# Altium project 616-demo-PRJ.PrjPCB
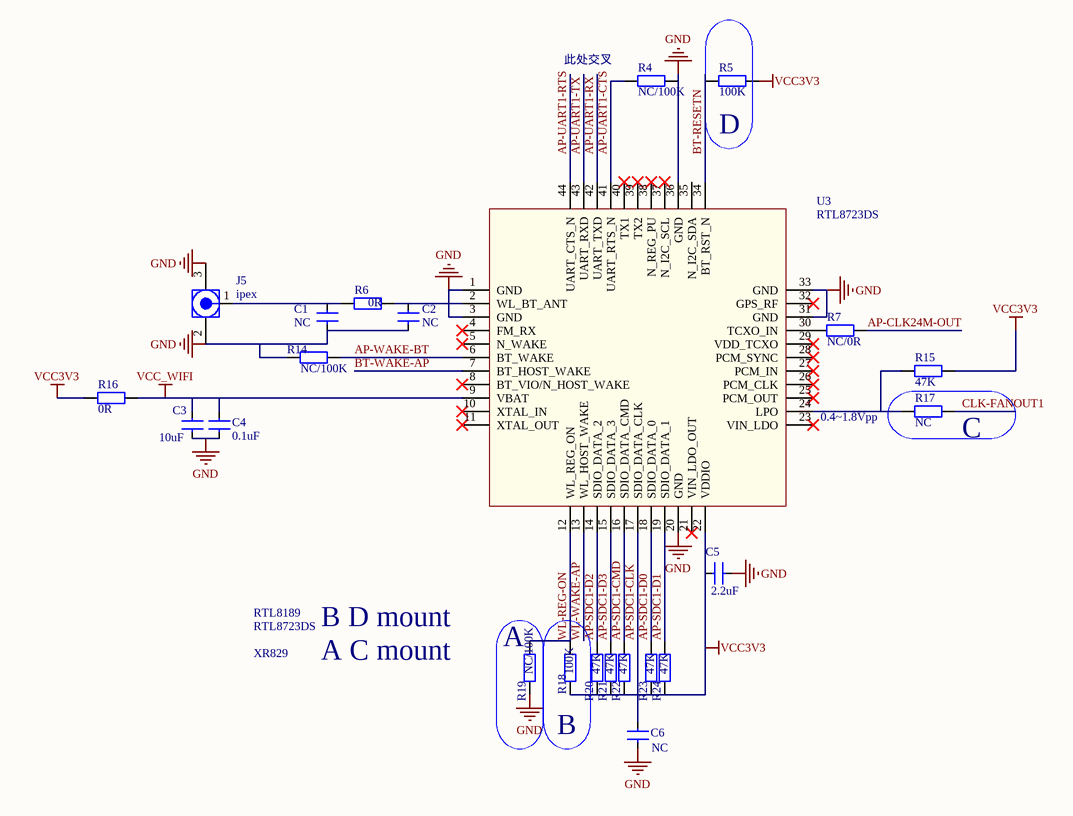
[diagram p0: WIFI-BT.SchDoc]
2 sheets, 70 parts. Net scope: global (net labels, ports and power ports of the same name join across sheets).
Board file: 616DEMO.PcbDoc
Sheets:
  WIFI-BT.SchDoc
  D1-Periph.SchDoc

## Sheet WIFI-BT.SchDoc
size A3

### Parts
C1  NC  [C0402]
C2  NC  [C0402]
C3  10uF  [C0402]
C4  0.1uF  [C0402]
C5  2.2uF  [C0402]
C6  NC  [C0402]
J5  ipex  [I-PEX SOCKET]
R4  NC/100K  [R0402]
R5  100K  [R0402]
R6  0R  [R0402]
R7  NC/0R  [R0402]
R14  NC/100K  [R0402]
R15  47K  [R0402]
R16  0R  [R0402]
R17  NC  [R0402]
R18  100K  [R0402]
R19  NC/100K  [R0402]
R20  47K  [R0402]
R21  47K  [R0402]
R22  47K  [R0402]
R23  47K  [R0402]
R24  47K  [R0402]
U3  RTL8723DS  [RTL8723DS]

### Blocks framed on the sheet
D: R5
A: R19
B: R18

### Nets
GND: C1.1 C2.1 C3.1 C4.1 C5.1 C6.1 J5.2(GND) J5.3(GND) R4.1 R14.2 R19.1 U3.1(GND) U3.3(GND) U3.20(GND) U3.31(GND) U3.33(GND) U3.36(GND)
VCC3V3: C5.2 R5.1 R15.2 R16.2 R18.1 R20.1 R21.1 R22.1 R23.1 R24.1 U3.22(VDDIO)
VCC_WIFI: C3.2 C4.2 R16.1 U3.9(VBAT)
AP-CLK24M-OUT: R7.1
AP-SDC1-CLK: C6.2 U3.17(SDIO_DATA_CLK)
AP-SDC1-CMD: R22.2 U3.16(SDIO_DATA_CMD)
AP-SDC1-D0: R23.2 U3.18(SDIO_DATA_0)
AP-SDC1-D1: R24.2 U3.19(SDIO_DATA_1)
AP-SDC1-D2: R20.2 U3.14(SDIO_DATA_2)
AP-SDC1-D3: R21.2 U3.15(SDIO_DATA_3)
AP-UART1-CTS: R4.2 U3.41(UART_RTS_N)
AP-UART1-RTS: U3.44(UART_CTS_N)
AP-UART1-RX: U3.42(UART_TXD)
AP-UART1-TX: U3.43(UART_RXD)
AP-WAKE-BT: R14.1 U3.6(BT_WAKE)
BT-RESETN: R5.2 U3.34(BT_RST_N)
BT-WAKE-AP: U3.7(BT_HOST_WAKE)
CLK-FANOUT1: R17.1
WL-REG-ON: R18.2 R19.2 U3.12(WL_REG_ON)
WL-WAKE-AP: U3.13(WL_HOST_WAKE)
NetC1_2: C1.2 J5.1(Signal) R6.2
NetC2_2: C2.2 R6.1 U3.2(WL_BT_ANT)
NetR7_2: R7.2 U3.30(TCXO_IN)
NetR15_1: R15.1 R17.2 U3.24(LPO)

Not connected (* = marked no-connect by the designer): U3 4(FM_RX)* 5(N_WAKE)* 8(BT_VIO/N_HOST_WAKE)* 10(XTAL_IN)* 11(XTAL_OUT)* 21(VIN_LDO_OUT)* 23(VIN_LDO)* 25(PCM_OUT)* 26(PCM_CLK)* 27(PCM_IN)* 28(PCM_SYNC)* 29(VDD_TCXO)* 32(GPS_RF)* 35(N_I2C_SDA) 37(N_I2C_SCL)* 38(N_REG_PU)* 39(TX2)* 40(TX1)*

### Notes on the sheet
- (near R4) 此处交叉
- 0.4~1.8Vpp
- (near R17) C
- RTL8723DS
- XR829
- RTL8189
- B D mount
- A C mount

### Library data of the parts
C1-C6 = CAP: 普通小电容
J5 = MCX_IPEX
R4-R7 R14-R24 = RES: 普通电阻
U3 = AP6212

## Sheet D1-Periph.SchDoc
size A3; DocumentNumber: 3; SheetNumber: 3; SheetTotal: 7
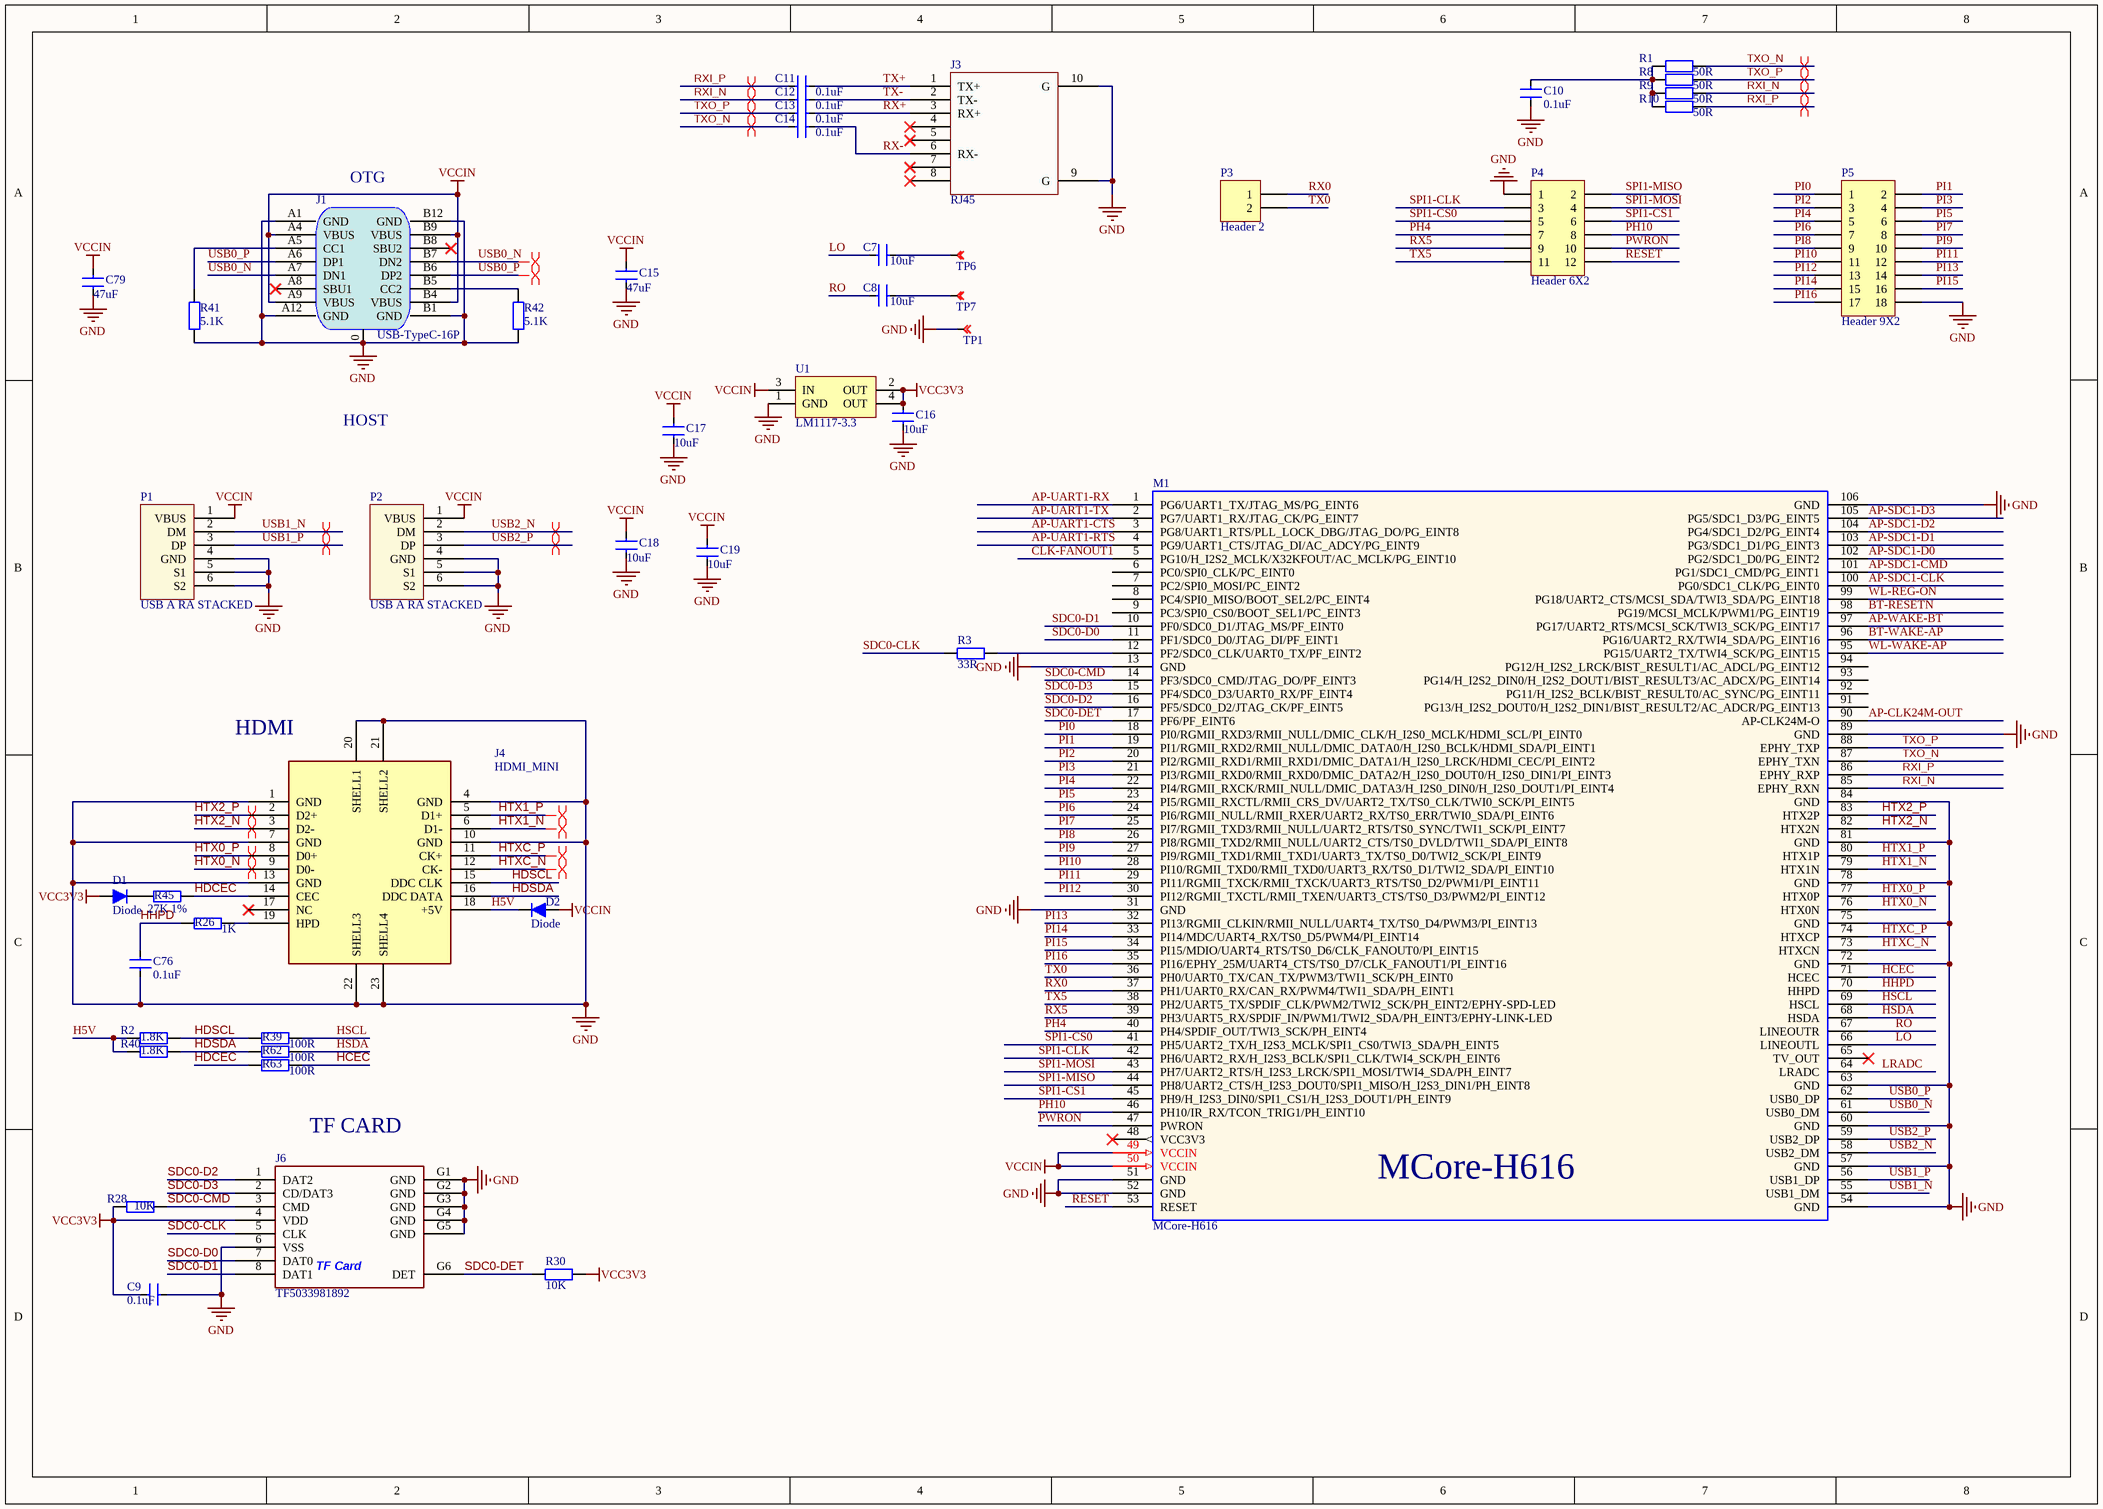
[diagram p1: D1-Periph.SchDoc]

### Parts
C7  10uF  [C0402]
C8  10uF  [C0402]
C9  0.1uF  [C0402]
C10  0.1uF  [C0402]
C11  0.1uF  [C0402]
C12  0.1uF  [C0402]
C13  0.1uF  [C0402]
C14  0.1uF  [C0402]
C15  47uF  [C0603]
C16  10uF  [C0402]
C17  10uF  [C0402]
C18  10uF  [C0402]
C19  10uF  [C0402]
C76  0.1uF  [C0402]
C79  47uF  [C0603]
D1  Diode  [SOD523]
D2  Diode  [SOD523]
J1  USB-TypeC-16P  [usb-typec-16p]
J3  RJ45  [RJ45]
J4  HDMI_MINI  [HDMI_T _mini]
J6  TF5033981892  [TFCARD-1040310811]
M1  MCore-H616  [MCore-H616]
P1  USB A RA STACKED  [USB-A STAND]
P2  USB A RA STACKED  [USB-A STAND]
P3  Header 2  [HDR1X2]
P4  Header 6X2  [HDR2X6]
P5  Header 9X2  [HDR2X9]
R1  50R  [R0402]
R2  1.8K  [R0402]
R3  33R  [R0402]
R8  50R  [R0402]
R9  50R  [R0402]
R10  50R  [R0402]
R26  1K  [R0402]
R28  10K  [R0402]
R30  10K  [R0402]
R39  100R  [R0402]
R40  1.8K  [R0402]
R41  5.1K  [R0402]
R42  5.1K  [R0402]
R45  27K 1%  [R0402]
R62  100R  [R0402]
R63  100R  [R0402]
TP1  TEST POINT  [TEST-POINT1.5]  (value not drawn)
TP6  TEST POINT  [TEST-POINT1.5]  (value not drawn)
TP7  TEST POINT  [TEST-POINT1.5]  (value not drawn)
U1  LM1117-3.3  [SOT223-4N]

### Nets
GND: C9.2 C10.1 C15.2 C16.2 C17.2 C18.2 C19.2 C76.1 C79.2 J1.0 J1.A1(GND) J1.A12(GND) J1.B1(GND) J1.B12(GND) J3.9(G) J3.10(G) J4.1(GND) J4.4(GND) J4.7(GND) J4.10(GND) J4.13(GND) J4.20(SHELL1) J4.21(SHELL2) J4.22(SHELL3) J4.23(SHELL4) J6.6(VSS) J6.G1(GND) J6.G2(GND) J6.G3(GND) J6.G4(GND) J6.G5(GND) M1.13(GND) M1.31(GND) M1.51(GND) M1.52(GND) M1.54(GND) M1.57(GND) M1.60(GND) M1.63(GND) M1.72(GND) M1.75(GND) M1.78(GND) M1.81(GND) M1.84(GND) M1.89(GND) M1.106(GND) P1.4(GND) P1.5(S1) P1.6(S2) P2.4(GND) P2.5(S1) P2.6(S2) P4.1 P5.18 R41.1 R42.1 TP1.1 U1.1(GND)
VCC3V3: C9.1 C16.1 D1.A J6.4(VDD) R28.1 R30.1 U1.2(OUT) U1.4(OUT)
VCCIN: C15.1 C17.1 C18.1 C19.1 C79.1 D2.A J1.A4(VBUS) J1.A9(VBUS) J1.B4(VBUS) J1.B9(VBUS) M1.49(VCCIN) M1.50(VCCIN) P1.1(VBUS) P2.1(VBUS) U1.3(IN)
AP-CLK24M-OUT: M1.90(AP-CLK24M-O)
AP-SDC1-CLK: M1.100(PG0/SDC1_CLK/PG_EINT0)
AP-SDC1-CMD: M1.101(PG1/SDC1_CMD/PG_EINT1)
AP-SDC1-D0: M1.102(PG2/SDC1_D0/PG_EINT2)
AP-SDC1-D1: M1.103(PG3/SDC1_D1/PG_EINT3)
AP-SDC1-D2: M1.104(PG4/SDC1_D2/PG_EINT4)
AP-SDC1-D3: M1.105(PG5/SDC1_D3/PG_EINT5)
AP-UART1-CTS: M1.3(PG8/UART1_RTS/PLL_LOCK_DBG/JTAG_DO/PG_EINT8)
AP-UART1-RTS: M1.4(PG9/UART1_CTS/JTAG_DI/AC_ADCY/PG_EINT9)
AP-UART1-RX: M1.1(PG6/UART1_TX/JTAG_MS/PG_EINT6)
AP-UART1-TX: M1.2(PG7/UART1_RX/JTAG_CK/PG_EINT7)
AP-WAKE-BT: M1.97(PG17/UART2_RTS/MCSI_SCK/TWI3_SCK/PG_EINT17)
BT-RESETN: M1.98(PG19/MCSI_MCLK/PWM1/PG_EINT19)
BT-WAKE-AP: M1.96(PG16/UART2_RX/TWI4_SDA/PG_EINT16)
CLK-FANOUT1: M1.5(PG10/H_I2S2_MCLK/X32KFOUT/AC_MCLK/PG_EINT10)
H5V: D2.K J4.18(+5V) R2.1 R40.1
HCEC: M1.71(HCEC) R63.1
HDCEC: J4.14(CEC) R45.1 R63.2
HDSCL: J4.15(DDC_CLK) R2.2 R39.2
HDSDA: J4.16(DDC_DATA) R40.2 R62.2
HHPD: C76.2 M1.70(HHPD) R26.2
HSCL: M1.69(HSCL) R39.1
HSDA: M1.68(HSDA) R62.1
HTX0_N: J4.9(D0-) M1.76(HTX0N)
HTX0_P: J4.8(D0+) M1.77(HTX0P)
HTX1_N: J4.6(D1-) M1.79(HTX1N)
HTX1_P: J4.5(D1+) M1.80(HTX1P)
HTX2_N: J4.3(D2-) M1.82(HTX2N)
HTX2_P: J4.2(D2+) M1.83(HTX2P)
HTXC_N: J4.12(CK-) M1.73(HTXCN)
HTXC_P: J4.11(CK+) M1.74(HTXCP)
LO: C7.1 M1.66(LINEOUTL)
LRADC: M1.64(LRADC)
PH4: M1.40(PH4/SPDIF_OUT/TWI3_SCK/PH_EINT4) P4.7
PH10: M1.46(PH10/IR_RX/TCON_TRIG1/PH_EINT10) P4.8
PI0: M1.18(PI0/RGMII_RXD3/RMII_NULL/DMIC_CLK/H_I2S0_MCLK/HDMI_SCL/PI_EINT0) P5.1
PI1: M1.19(PI1/RGMII_RXD2/RMII_NULL/DMIC_DATA0/H_I2S0_BCLK/HDMI_SDA/PI_EINT1) P5.2
PI2: M1.20(PI2/RGMII_RXD1/RMII_RXD1/DMIC_DATA1/H_I2S0_LRCK/HDMI_CEC/PI_EINT2) P5.3
PI3: M1.21(PI3/RGMII_RXD0/RMII_RXD0/DMIC_DATA2/H_I2S0_DOUT0/H_I2S0_DIN1/PI_EINT3) P5.4
PI4: M1.22(PI4/RGMII_RXCK/RMII_NULL/DMIC_DATA3/H_I2S0_DIN0/H_I2S0_DOUT1/PI_EINT4) P5.5
PI5: M1.23(PI5/RGMII_RXCTL/RMII_CRS_DV/UART2_TX/TS0_CLK/TWI0_SCK/PI_EINT5) P5.6
PI6: M1.24(PI6/RGMII_NULL/RMII_RXER/UART2_RX/TS0_ERR/TWI0_SDA/PI_EINT6) P5.7
PI7: M1.25(PI7/RGMII_TXD3/RMII_NULL/UART2_RTS/TS0_SYNC/TWI1_SCK/PI_EINT7) P5.8
PI8: M1.26(PI8/RGMII_TXD2/RMII_NULL/UART2_CTS/TS0_DVLD/TWI1_SDA/PI_EINT8) P5.9
PI9: M1.27(PI9/RGMII_TXD1/RMII_TXD1/UART3_TX/TS0_D0/TWI2_SCK/PI_EINT9) P5.10
PI10: M1.28(PI10/RGMII_TXD0/RMII_TXD0/UART3_RX/TS0_D1/TWI2_SDA/PI_EINT10) P5.11
PI11: M1.29(PI11/RGMII_TXCK/RMII_TXCK/UART3_RTS/TS0_D2/PWM1/PI_EINT11) P5.12
PI12: M1.30(PI12/RGMII_TXCTL/RMII_TXEN/UART3_CTS/TS0_D3/PWM2/PI_EINT12) P5.13
PI13: M1.32(PI13/RGMII_CLKIN/RMII_NULL/UART4_TX/TS0_D4/PWM3/PI_EINT13) P5.14
PI14: M1.33(PI14/MDC/UART4_RX/TS0_D5/PWM4/PI_EINT14) P5.15
PI15: M1.34(PI15/MDIO/UART4_RTS/TS0_D6/CLK_FANOUT0/PI_EINT15) P5.16
PI16: M1.35(PI16/EPHY_25M/UART4_CTS/TS0_D7/CLK_FANOUT1/PI_EINT16) P5.17
PWRON: M1.47(PWRON) P4.10
RESET: M1.53(RESET) P4.12
RO: C8.1 M1.67(LINEOUTR)
RX0: M1.37(PH1/UART0_RX/CAN_RX/PWM4/TWI1_SDA/PH_EINT1) P3.1
RX5: M1.39(PH3/UART5_RX/SPDIF_IN/PWM1/TWI2_SDA/PH_EINT3/EPHY-LINK-LED) P4.9
RX+: C13.2 J3.3(RX+)
RX-: C14.2 J3.6(RX-)
RXI_N: C12.1 M1.85(EPHY_RXN) R9.1
RXI_P: C11.1 M1.86(EPHY_RXP) R10.1
SDC0-CLK: J6.5(CLK) R3.2
SDC0-CMD: J6.3(CMD) M1.14(PF3/SDC0_CMD/JTAG_DO/PF_EINT3) R28.2
SDC0-D0: J6.7(DAT0) M1.11(PF1/SDC0_D0/JTAG_DI/PF_EINT1)
SDC0-D1: J6.8(DAT1) M1.10(PF0/SDC0_D1/JTAG_MS/PF_EINT0)
SDC0-D2: J6.1(DAT2) M1.16(PF5/SDC0_D2/JTAG_CK/PF_EINT5)
SDC0-D3: J6.2(CD/DAT3) M1.15(PF4/SDC0_D3/UART0_RX/PF_EINT4)
SDC0-DET: J6.G6(DET) M1.17(PF6/PF_EINT6) R30.2
SPI1-CLK: M1.42(PH6/UART2_RX/H_I2S3_BCLK/SPI1_CLK/TWI4_SCK/PH_EINT6) P4.3
SPI1-CS0: M1.41(PH5/UART2_TX/H_I2S3_MCLK/SPI1_CS0/TWI3_SDA/PH_EINT5) P4.5
SPI1-CS1: M1.45(PH9/H_I2S3_DIN0/SPI1_CS1/H_I2S3_DOUT1/PH_EINT9) P4.6
SPI1-MISO: M1.44(PH8/UART2_CTS/H_I2S3_DOUT0/SPI1_MISO/H_I2S3_DIN1/PH_EINT8) P4.2
SPI1-MOSI: M1.43(PH7/UART2_RTS/H_I2S3_LRCK/SPI1_MOSI/TWI4_SDA/PH_EINT7) P4.4
TX0: M1.36(PH0/UART0_TX/CAN_TX/PWM3/TWI1_SCK/PH_EINT0) P3.2
TX5: M1.38(PH2/UART5_TX/SPDIF_CLK/PWM2/TWI2_SCK/PH_EINT2/EPHY-SPD-LED) P4.11
TX+: C11.2 J3.1(TX+)
TX-: C12.2 J3.2(TX-)
TXO_N: C14.1 M1.87(EPHY_TXN) R1.1
TXO_P: C13.1 M1.88(EPHY_TXP) R8.1
USB0_N: J1.A7(DN1) J1.B7(DN2) M1.61(USB0_DM)
USB0_P: J1.A6(DP1) J1.B6(DP2) M1.62(USB0_DP)
USB1_N: M1.55(USB1_DM) P1.2(DM)
USB1_P: M1.56(USB1_DP) P1.3(DP)
USB2_N: M1.58(USB2_DM) P2.2(DM)
USB2_P: M1.59(USB2_DP) P2.3(DP)
WL-REG-ON: M1.99(PG18/UART2_CTS/MCSI_SDA/TWI3_SDA/PG_EINT18)
WL-WAKE-AP: M1.95(PG15/UART2_TX/TWI4_SCK/PG_EINT15)
NetC7_2: C7.2 TP6.1
NetC8_2: C8.2 TP7.1
NetC10_2: C10.2 R1.2 R8.2 R9.2 R10.2
NetD1_K: D1.K R45.2
NetJ1_A5: J1.A5(CC1) R41.2
NetJ1_B5: J1.B5(CC2) R42.2
NetJ4_19: J4.19(HPD) R26.1
NetM1_12: M1.12(PF2/SDC0_CLK/UART0_TX/PF_EINT2) R3.1

Not connected (* = marked no-connect by the designer): J1 A8(SBU1)* B8(SBU2)*; J3 4* 5* 7* 8*; J4 17(NC)*; M1 6(PC0/SPI0_CLK/PC_EINT0) 7(PC2/SPI0_MOSI/PC_EINT2) 8(PC4/SPI0_MISO/BOOT_SEL2/PC_EINT4) 9(PC3/SPI0_CS0/BOOT_SEL1/PC_EINT3) 48(VCC3V3)* 65(TV_OUT)* 91(PG13/H_I2S2_DOUT0/H_I2S2_DIN1/BIST_RESULT2/AC_ADCR/PG_EINT13) 92(PG11/H_I2S2_BCLK/BIST_RESULT0/AC_SYNC/PG_EINT11) 93(PG14/H_I2S2_DIN0/H_I2S2_DOUT1/BIST_RESULT3/AC_ADCX/PG_EINT14) 94(PG12/H_I2S2_LRCK/BIST_RESULT1/AC_ADCL/PG_EINT12)

### Layout directives
differential pair: HTX0_N, HTX0_P, HTX1_N, HTX1_P, HTX2_N, HTX2_P, HTXC_N, HTXC_P, RXI_N, RXI_P, TXO_N, TXO_P, USB0_N, USB0_P, USB1_N, USB1_P, USB2_N, USB2_P

### Notes on the sheet
- (near J1) OTG
- HOST
- (near J4) HDMI
- TF CARD
- (in symbol TF5033981892) TF Card

### Library data of the parts
C7-C19 C76 C79 = CAP: 普通小电容
D1 D2 = Diode: 普通二极管
J3 = RJ45: RJ45不带网络变压器
P1 P2 = USB A Right Angle Stacked: CONN RECEPT STACKED USB A RT ANG; Category: 其它连接器; ComnentNum: *; Manufacturer: *; Note: Note; Part: *
P3 = Header 2: Header, 2-Pin; LatestRevisionDate: 17-Jul-2002; LatestRevisionNote: Re-released for DXP Platform.; Publisher: Altium Limited
P4 = Header 6X2: Header, 6-Pin, Dual row; LatestRevisionDate: 17-Jul-2002; LatestRevisionNote: Re-released for DXP Platform.; Publisher: Altium Limited
P5 = Header 9X2: Header, 9-Pin, Dual row; LatestRevisionDate: 17-Jul-2002; LatestRevisionNote: Re-released for DXP Platform.; Publisher: Altium Limited
R1-R3 R8-R10 R26 R28 R30 R39-R42 R45 R62 R63 = RES: 普通电阻
TP1 TP6 TP7 = TP: Description
U1 = LM1117-3.3: 800mA and 1A Low Dropout Positive Regulator 2.85V, 3.3V, 5V, and Adjustable; PackageDocument: revC; Published: 8-Jun-2000; LatestRevisionDate: 17-Jul-2002; LatestRevisionNote: Re-released for DXP Platform.; DatasheetDocument: Sep-1997; PackageReference: ZZ311; Publisher: Altium Limited; ComponentLink1Description: Manufacturer Link; ComponentLink1URL: http://www.ti.com/

## Nets that join several sheets
GND: WIFI-BT (17 pins), D1-Periph (58 pins)
VCC3V3: WIFI-BT (11 pins), D1-Periph (8 pins)
AP-CLK24M-OUT: WIFI-BT (R7.1), D1-Periph (M1.90)
AP-SDC1-CLK: WIFI-BT (C6.2 U3.17), D1-Periph (M1.100)
AP-SDC1-CMD: WIFI-BT (R22.2 U3.16), D1-Periph (M1.101)
AP-SDC1-D0: WIFI-BT (R23.2 U3.18), D1-Periph (M1.102)
AP-SDC1-D1: WIFI-BT (R24.2 U3.19), D1-Periph (M1.103)
AP-SDC1-D2: WIFI-BT (R20.2 U3.14), D1-Periph (M1.104)
AP-SDC1-D3: WIFI-BT (R21.2 U3.15), D1-Periph (M1.105)
AP-UART1-CTS: WIFI-BT (R4.2 U3.41), D1-Periph (M1.3)
AP-UART1-RTS: WIFI-BT (U3.44), D1-Periph (M1.4)
AP-UART1-RX: WIFI-BT (U3.42), D1-Periph (M1.1)
AP-UART1-TX: WIFI-BT (U3.43), D1-Periph (M1.2)
AP-WAKE-BT: WIFI-BT (R14.1 U3.6), D1-Periph (M1.97)
BT-RESETN: WIFI-BT (R5.2 U3.34), D1-Periph (M1.98)
BT-WAKE-AP: WIFI-BT (U3.7), D1-Periph (M1.96)
CLK-FANOUT1: WIFI-BT (R17.1), D1-Periph (M1.5)
WL-REG-ON: WIFI-BT (R18.2 R19.2 U3.12), D1-Periph (M1.99)
WL-WAKE-AP: WIFI-BT (U3.13), D1-Periph (M1.95)